# EAGLE board MegaFly_rev4.1.1 (EAGLE 6.5.0)
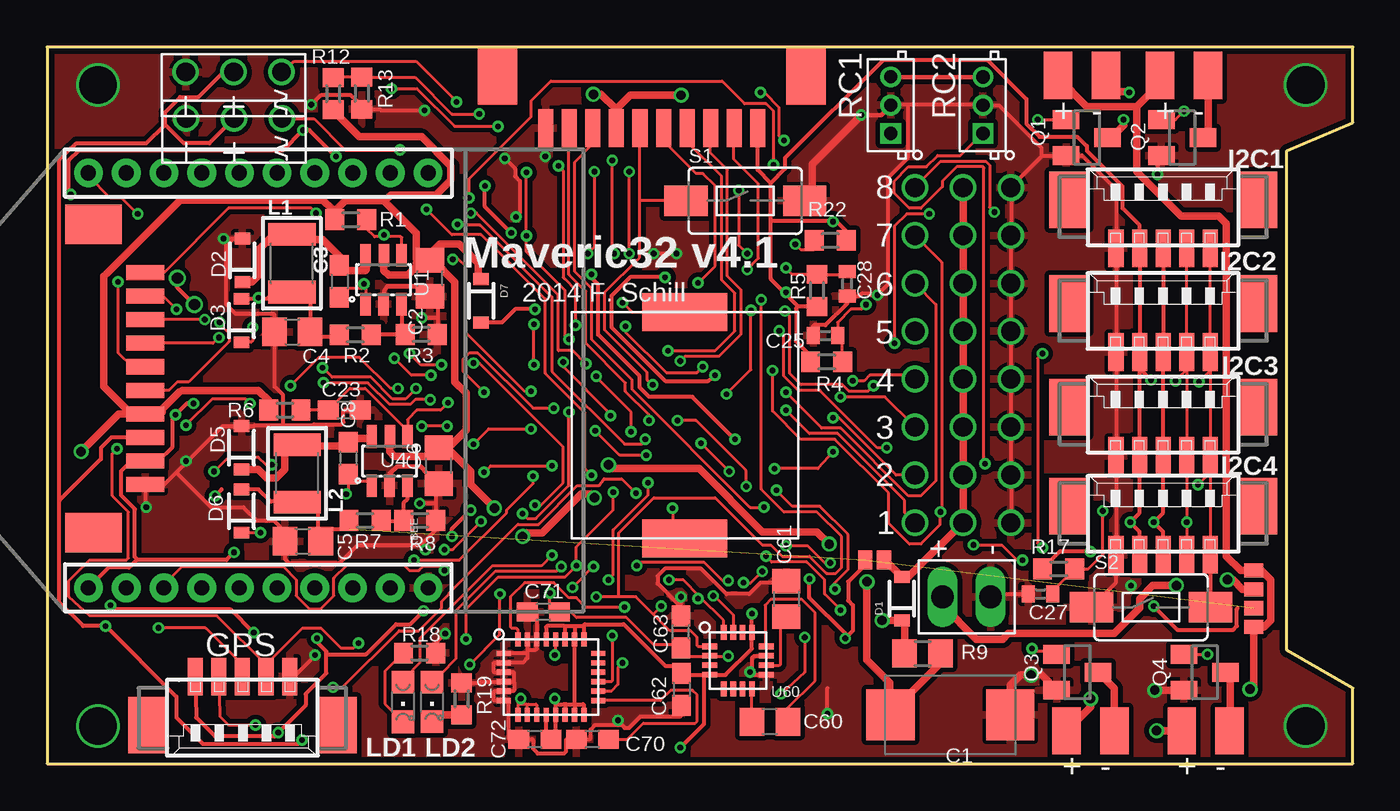
[diagram p2: board, top side]
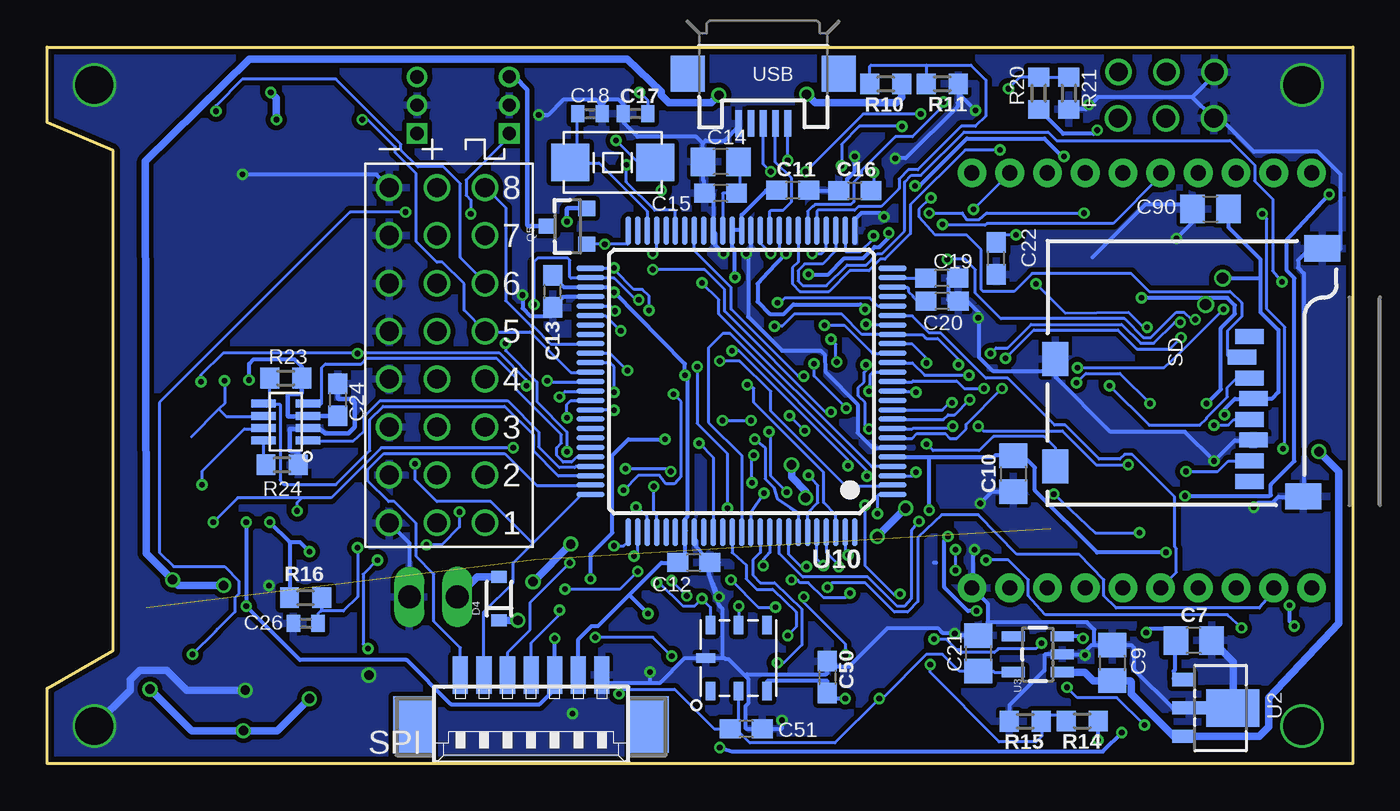
[diagram p3: board, bottom side, seen from below]

Size 69.2 x 38 mm. Coordinates in mm from the lower left corner, seen from the top.
Outline: 0,0 69.2,0 69.2,4 65.7,6 65.7,32.5 69.2,34 69.2,38 0,38 0,0
Copper layers (1*16): Top 0.035mm / dielectric 1.5mm / Bottom 0.035mm
Design rules "PCB-POOL Standard": minimum track width 0.15mm, minimum drill 0.3mm, track to track 0.15mm, track to pad 0.15mm, pad to pad 0.15mm, via to via 0.15mm, smd to smd 0.15mm, copper to edge 0.3mm, drill to drill 0.2mm, minimum pad ring 0.2mm, minimum via ring 0.15mm, stop-mask expansion 0.075mm, vias tented up to drill 0mil, thermal gap 0.2mm
Net classes: 0 default: width 0.15 mm, drill 0.3 mm, clearance 0.15 mm; 1 power: width 0.2 mm, drill 0.3 mm, clearance 0.15 mm; 2 more_power: width 0.4 mm, drill 0.5 mm, clearance 0.15 mm

## Footprints (pad centres in the part's own frame; a part is rotated, then mirrored left to right if it is on the bottom)
MOLEX_CONNECTOR_10PINS = smd 0.8 x 2: P$1 -11.65,-0.65; P$2 -10.4,-0.65; P$3 -9.15,-0.65; P$4 -7.9,-0.65; P$5 -6.65,-0.65; P$6 -5.4,-0.65; P$7 -4.15,-0.65; P$8 -2.9,-0.65; P$9 -1.65,-0.65; P$10 -0.4,-0.65 | smd 2.1 x 3: P$11 -14.2,-3.4; P$12 2.15,-3.4
D/7343-31R = smd 2.55 x 2.7: + 3.175,0; - -3.175,0
C0805 = smd 1.3 x 1.5: 1 -0.95,0; 2 0.95,0
C0603 = smd 1.1 x 1: 1 -0.85,0; 2 0.85,0
C0402 = smd 0.7 x 0.9: 1 -0.65,0; 2 0.65,0
SOD-323 = smd 0.63 x 0.83: 1 -1.15,0; 2 1.15,0
MOLEX_CONNECTOR_5_PINS_VERTICAL = smd 0.8 x 2: 1 2.5,-2.82; 2 1.25,-2.82; 3 0,-2.82; 4 -1.25,-2.82; 5 -2.5,-2.82 | smd 2.1 x 3: S1 5,-0.25; S2B -5,-0.25
SOLDER_JUMPER_2WAY = smd 0.75 x 1: P$1 -0.5,0; P$2 0.5,0
C1210 = smd 1.2 x 2.5: 1 -1.524,0; 2 1.524,0
CHIPLED_0805 = smd 1.2 x 1.2: A 0,-1.05; C 0,1.05
POWER = drill 1.2 long: P$1 0,2.54; P$2 0,0
JST_1.5MM_3WAY = drill 0.7 square: P$1 0,1.5 | drill 0.7: P$2 0,0; P$3 0,-1.5
SERVO_COMPACT = drill 1: P$1 0,2.54; P$2 0,0; P$3 0,-2.54
POWER_SMALL_SMD = smd 1.5 x 2.5: + -1.27,0; - 1.27,0
SOT23 = smd 1 x 1.4: 1 -0.95,-1.1; 2 0.95,-1.1; 3 0,1.1
SOT23-3 = smd 0.8 x 0.9: 1 -0.95,-1; 2 0.95,-1; 3 0,1.1
R0603 = smd 1 x 1.1: 1 -0.85,0; 2 0.85,0
R0805 = smd 1.3 x 1.5: 1 -0.95,0; 2 0.95,0
TACTILE-SWITCH-1101NE = smd 2.3 x 1.6: P$1 -3.15,0; P$2 3.15,0
MICRO-SD-SOCKET-PP = smd 0.8 x 1.5: 1 -8.94,10.7; 2 -7.84,10.3; 3 -6.74,10.7; 4 -5.64,10.9; 5 -4.54,10.7; 6 -3.44,10.9; 7 -2.34,10.7; 8 -1.24,10.7 | smd 1.8 x 1.4: CD1 -2.05,0.4; CD2 -7.75,0.4 | smd 1.4 x 1.9: GND1 -13.6,14.55; GND3 -0.45,13.55
HEADER3X8 = drill 1.016: P$1 -2.54,10.16; P$2 0,10.16; P$3 2.54,10.16; P$4 -2.54,7.62; P$5 0,7.62; P$6 2.54,7.62; P$7 -2.54,5.08; P$8 0,5.08; P$9 2.54,5.08; P$10 -2.54,2.54; P$11 0,2.54; P$12 2.54,2.54; P$13 -2.54,0; P$14 0,0; P$15 2.54,0; P$16 -2.54,-2.54; P$17 0,-2.54; P$18 2.54,-2.54; P$19 -2.54,-5.08; P$20 0,-5.08; P$21 2.54,-5.08; P$22 -2.54,-7.62; P$23 0,-7.62; P$24 2.54,-7.62
SOT23-8L = smd 1.3 x 0.42: P$1 -1.175,1.3; P$2 -1.175,0.65; P$3 -1.175,0; P$4 -1.175,-0.65; P$5 1.175,-0.65; P$6 1.175,0; P$7 1.175,0.65; P$8 1.175,1.3
PIEZO_CMT_1203-SMT-REDUCED_FOOTPRINT = smd 4.5 x 2: P$1 0,6; P$2 0,-6
MOLEX_CONNECTOR_7PINS = smd 0.8 x 2: 1 3.75,-2; 2 2.5,-2; 3 1.25,-2; 4 0,-2; 5 -1.25,-2; 6 -2.5,-2; 7 -3.75,-2 | smd 2.1 x 3: S1 6.25,0.625; S2 -6.25,0.625
SOT23-6 = smd 0.55 x 1.2: 1 -0.95,-1.3; 2 0,-1.3; 3 0.95,-1.3; 4 0.95,1.3; 5 0.015,1.3; 6 -0.95,1.3
SOT89 = smd 0.7 x 1.1: 1 -1.5,-1.75; 3 1.5,-1.75 | smd 0.7 x 1.8: 2 0,-1.4 | smd 2 x 2.8: 4 0,0.9
SOT23-5 = smd 0.55 x 1.2: 1 -0.95,-1.3; 2 0,-1.3; 3 0.95,-1.3; 4 0.95,1.3; 5 -0.95,1.3
TQFP100 = smd 1.5 x 0.3: 1 -8,6; 2 -8,5.5; 3 -8,5; 4 -8,4.5; 5 -8,4; 6 -8,3.5; 7 -8,3; 8 -8,2.5; 9 -8,2; 10 -8,1.5; 11 -8,1; 12 -8,0.5; 13 -8,0; 14 -8,-0.5; 15 -8,-1; 16 -8,-1.5; 17 -8,-2; 18 -8,-2.5; 19 -8,-3; 20 -8,-3.5; 21 -8,-4; 22 -8,-4.5; 23 -8,-5; 24 -8,-5.5; 25 -8,-6; 51 8,-6; 52 8,-5.5; 53 8,-5; 54 8,-4.5; 55 8,-4; 56 8,-3.5; 57 8,-3; 58 8,-2.5; 59 8,-2; 60 8,-1.5; 61 8,-1; 62 8,-0.5; 63 8,0; 64 8,0.5; 65 8,1; 66 8,1.5; 67 8,2; 68 8,2.5; 69 8,3; 70 8,3.5; 71 8,4; 72 8,4.5; 73 8,5; 74 8,5.5; 75 8,6 | smd 0.3 x 1.5: 26 -6,-8; 27 -5.5,-8; 28 -5,-8; 29 -4.5,-8; 30 -4,-8; 31 -3.5,-8; 32 -3,-8; 33 -2.5,-8; 34 -2,-8; 35 -1.5,-8; 36 -1,-8; 37 -0.5,-8; 38 0,-8; 39 0.5,-8; 40 1,-8; 41 1.5,-8; 42 2,-8; 43 2.5,-8; 44 3,-8; 45 3.5,-8; 46 4,-8; 47 4.5,-8; 48 5,-8; 49 5.5,-8; 50 6,-8; 76 6,8; 77 5.5,8; 78 5,8; 79 4.5,8; 80 4,8; 81 3.5,8; 82 3,8; 83 2.5,8; 84 2,8; 85 1.5,8; 86 1,8; 87 0.5,8; 88 0,8; 89 -0.5,8; 90 -1,8; 91 -1.5,8; 92 -2,8; 93 -2.5,8; 94 -3,8; 95 -3.5,8; 96 -4,8; 97 -4.5,8; 98 -5,8; 99 -5.5,8; 100 -6,8
BMP180 = smd 0.5 x 1: 1 -1.5,-1.75; 2 0,-1.75; 3 1.5,-1.75; 4 1.5,1.75; 5 0,1.75; 6 -1.5,1.75 | smd 1 x 0.5: 7 -1.75,0
LPCC16_0.5MM = smd 0.8 x 0.3: P$1 -1.5,0.75; P$2 -1.5,0.25; P$3 -1.5,-0.25; P$4 -1.5,-0.75; P$9 1.5,-0.75; P$10 1.5,-0.25; P$11 1.5,0.25; P$12 1.5,0.75 | smd 0.3 x 0.8: P$5 -0.75,-1.5; P$6 -0.25,-1.5; P$7 0.25,-1.5; P$8 0.75,-1.5; P$13 0.75,1.5; P$14 0.25,1.5; P$15 -0.25,1.5; P$16 -0.75,1.5
LSM330DLC = smd 0.75 x 0.28: P$1 -2.5,1.25; P$2 -2.5,0.75; P$3 -2.5,0.25; P$4 -2.5,-0.25; P$5 -2.5,-0.75; P$6 -2.5,-1.25; P$15 2.5,-1.25; P$16 2.5,-0.75; P$17 2.5,-0.25; P$18 2.5,0.25; P$19 2.5,0.75; P$20 2.5,1.25 | smd 0.28 x 0.75: P$7 -1.75,-2; P$8 -1.25,-2; P$9 -0.75,-2; P$10 -0.25,-2; P$11 0.25,-2; P$12 0.75,-2; P$13 1.25,-2; P$14 1.75,-2; P$21 1.75,2; P$22 1.25,2; P$23 0.75,2; P$24 0.25,2; P$25 -0.25,2; P$26 -0.75,2; P$27 -1.25,2; P$28 -1.75,2
USB-MICROB = smd 0.35 x 1.4: D+ 0,2.65; D- -0.65,2.65; GND 1.3,2.65; ID 0.65,2.65; VBUS -1.3,2.65 | smd 1.8 x 1.9: MT1 -4,0; MT2 4,0
SMD_CRYSTAL_ABM = smd 2 x 2: P$1 -2.25,0; P$2 2.25,0
XBEE-1 = drill 0.8 pad 1.524: 1 -11,20; 2 -11,18; 3 -11,16; 4 -11,14; 5 -11,12; 6 -11,10; 7 -11,8; 8 -11,6; 9 -11,4; 10 -11,2; 11 11,2; 12 11,4; 13 11,6; 14 11,8; 15 11,10; 16 11,12; 17 11,14; 18 11,16; 19 11,18; 20 11,20

## Placement (x,y rotation side)
ANA  MOLEX_CONNECTOR_10PINSMOLEX_PICOBLADE  [MOLEX_CONNECTOR_10PINS]  5.85,14.4 270 top
C1  100uF  [D/7343-31R]  47.87,2.59 180 top
C2  10uF  [C0805]  20.28,25.73 90 top
C3  100nF  [C0603]  15.49,25.58 270 top
C4  10uF  [C0805]  12.99,22.9 0 top
C5  10uF  [C0805]  13.55,11.8 0 top
C6  10uF  [C0805]  20.75,15.8 90 top
C7  10uF  [C0805]  8.43,6.53 180 bottom
C8  100nF  [C0603]  15.95,16.2 270 top
C9  10uF  [C0805]  12.75,5.35 270 bottom
C10  10uF  [C0805]  18,15.38 270 bottom
C11  100nF  [C0603]  29.69,30.41 180 bottom
C12  100nF  [C0603]  34.93,10.67 180 bottom
C13  100nF  [C0603]  42.4,25.05 90 bottom
C14  10uF  [C0805]  33.5,31.92 180 bottom
C15  100nF  [C0603]  33.51,30.26 180 bottom
C16  100nF  [C0603]  26.39,30.38 0 bottom
C17  22pF  [C0402]  38.01,34.48 180 bottom
C18  22pF  [C0402]  40.44,34.46 0 bottom
C19  100nF  [C0603]  21.78,25.75 180 bottom
C20  100nF  [C0603]  21.77,24.53 180 bottom
C21  10uF  [C0805]  19.85,5.85 270 bottom
C22  100nF  [C0603]  18.9,26.8 90 bottom
C23  100nF  [C0603]  15.75,18.75 180 top
C24  100nF  [C0603]  53.8,19.3 270 bottom
C25  22pF  [C0402]  41.25,22.7 0 top
C26  22pF  [C0402]  55.5,7.45 0 bottom
C27  22pF  [C0402]  52.65,9 0 top
C28  22pF  [C0402]  42.4,25.45 90 top
C50  100nF  [C0603]  27.86,4.59 270 bottom
C51  100nF  [C0603]  32.15,1.85 180 bottom
C60  220nF  [C0805]  38.3,2.22 180 top
C61  4.7uF  [C0805]  39.17,8.74 270 top
C62  100nF  [C0603]  33.62,3.94 270 top
C63  100nF  [C0603]  33.59,6.99 90 top
C70  100nF  [C0603]  28.9,1.3 180 top
C71  100nF  [C0603]  26.3,8.05 180 top
C72  100nF  [C0603]  25.85,1.3 180 top
C90  10uF  [C0805]  7.55,29.42 0 bottom
D1  [SOD-323]  45.3,8.75 90 top
D2  [SOD-323]  10.35,26.7 90 top
D3  [SOD-323]  10.3,23.5 90 top
D4  [SOD-323]  45.25,8.75 90 bottom
D5  [SOD-323]  10.3,16.75 90 top
D6  [SOD-323]  10.3,13.4 90 top
D7  [SOD-323]  23,24.55 270 top
GPS  APM2.5_GPS_HEADERVERTICAL  [MOLEX_CONNECTOR_5_PINS_VERTICAL]  10.35,1.8 180 top
I2C1  I2C_BUS_PICOVERTICAL  [MOLEX_CONNECTOR_5_PINS_VERTICAL]  59.15,30.15 0 top
I2C2  I2C_BUS_PICOVERTICAL  [MOLEX_CONNECTOR_5_PINS_VERTICAL]  59.15,24.65 0 top
I2C3  I2C_BUS_PICOVERTICAL  [MOLEX_CONNECTOR_5_PINS_VERTICAL]  59.15,19.15 0 top
I2C4  I2C_BUS_PICOVERTICAL  [MOLEX_CONNECTOR_5_PINS_VERTICAL]  59.15,13.9 0 top
J1  SOLDER_JUMPER_2WAY  [SOLDER_JUMPER_2WAY]  43.85,10.8 180 top
J2  SOLDER_JUMPER_2WAY  [SOLDER_JUMPER_2WAY]  63.95,9.75 270 top
J3  SOLDER_JUMPER_2WAY  [SOLDER_JUMPER_2WAY]  63.95,7.75 90 top
L1  10uH  [C1210]  12.97,26.54 270 top
L2  10uH  [C1210]  13.25,15.4 270 top
LD1  green  [CHIPLED_0805]  18.86,3.27 180 top
LD2  red  [CHIPLED_0805]  20.4,3.28 180 top
P1  POWER  [POWER]  50,8.84 90 top
P2  AVR32_JTAG+SERIALMOLEX_PICOBLADE  [MOLEX_CONNECTOR_10PINS]  26.02,33.05 180 top
P5  SPEKTRUM_RECEIVER  [JST_1.5MM_3WAY]  44.7,34.93 180 top
P6  SPEKTRUM_RECEIVER  [JST_1.5MM_3WAY]  49.59,34.92 180 top
P8  SENSOR  [SERVO_COMPACT]  9.88,36.68 270 top
P9  SENSOR  [SERVO_COMPACT]  9.91,34.23 270 top
P10  POWERSMALL_SMD  [POWER_SMALL_SMD]  54.85,36.5 0 top
P11  POWERSMALL_SMD  [POWER_SMALL_SMD]  60.25,36.5 0 top
P12  POWERSMALL_SMD  [POWER_SMALL_SMD]  55.3,1.75 0 top
P13  POWERSMALL_SMD  [POWER_SMALL_SMD]  61.4,1.75 0 top
Q1  N-CHANNEL_SOT23  [SOT23]  55.1,33.2 270 top
Q2  N-CHANNEL_SOT23  [SOT23]  60.15,33.2 270 top
Q3  N-CHANNEL_SOT23  [SOT23]  54.6,4.85 270 top
Q4  N-CHANNEL_SOT23  [SOT23]  61.35,4.85 270 top
Q5  MOSFET-PCHANNELSMD  [SOT23-3]  41.6,28.5 90 bottom
R1  100k  [R0603]  16.09,28.85 180 top
R2  31.6k  [R0603]  16.33,22.74 0 top
R3  10k  [R0603]  19.83,22.76 0 top
R4  6k8  [R0603]  41.31,21.31 0 top
R5  6k8  [R0603]  40.8,25.1 90 top
R6  100k  [R0603]  12.6,18.75 180 top
R7  56k  [R0603]  16.85,12.9 0 top
R8  10k  [R0603]  19.75,12.9 0 top
R9  0.25R  [R0805]  46.4,5.85 0 top
R10  22k  [R0603]  24.76,36.04 0 bottom
R11  1k  [R0603]  21.76,36.05 180 bottom
R12  22k  [R0603]  15.16,35.53 270 top
R13  1k  [R0603]  16.68,35.55 90 top
R14  18k  [R0603]  14.34,2.27 0 bottom
R15  2.2k  [R0603]  17.35,2.25 0 bottom
R16  6k8  [R0603]  55.51,8.8 0 bottom
R17  6k8  [R0603]  53.61,10.33 0 top
R18  1k  [R0603]  19.74,5.87 180 top
R19  1k  [R0603]  21.96,3.45 270 top
R20  18k  [R0603]  16.65,35.55 270 bottom
R21  2.2k  [R0603]  15.05,35.55 90 bottom
R22  1k  [R0603]  41.5,27.75 180 top
R23  1k  [R0603]  56.55,20.45 0 bottom
R24  25k  [R0603]  56.75,15.85 0 bottom
S1  SWITCH-MOMENTARY-2SMD-1101NE  [TACTILE-SWITCH-1101NE]  37,29.85 0 top
S2  SWITCH-MOMENTARY-2SMD-1101NE  [TACTILE-SWITCH-1101NE]  58.5,8.3 0 top
SD  USD-SOCKETNEW  [MICRO-SD-SOCKET-PP]  16.17,13.72 270 bottom
SERVO  SERVOCONNECTOR_X8STANDARD  [HEADER3X8]  48.54,22.93 180 bottom
SOT1  MAX3051  [SOT23-8L]  56.55,18.45 180 bottom
SP  PIEZO_SPEAKERSMALLER  [PIEZO_CMT_1203-SMT-REDUCED_FOOTPRINT]  33.8,17.95 0 top
SPI  MOLEX_CONNECTOR_7PINS  [MOLEX_CONNECTOR_7PINS]  43.55,2.7 180 bottom
U1  LM2734  [SOT23-6]  17.83,25.66 0 top
U2  MC78L05  [SOT89]  7.27,2.96 270 bottom
U3  V_REG_MIC5235-3.3  [SOT23-5]  16.7,5.8 90 bottom
U4  LM2734  [SOT23-6]  18.15,16.05 0 top
U10  AT32UC3C1512/1256/1128  [TQFP100]  32.4,20.27 180 bottom
U50  BMP180  [BMP180]  32.55,5.6 0 bottom
U60  HMC5883L  [LPCC16_0.5MM]  36.61,5.47 0 top
U70  LSM330DLC  [LSM330DLC]  26.7,4.6 0 top
USB  USB-MICROB  [USB-MICROB]  31.25,36.6 180 bottom
X1  CRYSTAL:ABM_16MHz  [SMD_CRYSTAL_ABM]  39.22,31.88 0 bottom
XBEE  XBEE-1B1  [XBEE-1]  22.19,20.33 90 top

## Tracks (layer width: path | path; a pad name or v marks a point on that pad's centre or on a via)
3V3_ANA  (via drill 0.3)
  Top 0.15: U70.P$7 24.95,3.1 25,3.15 | 25,3.15 25.4,3.15 25.45,3.1 | U70.P$8 25.45,3.1 | U70.P$9 25.95,3.1 25.9,3.15 25.5,3.15 25.45,3.1 | v25.1,3.45 24.95,3.3 24.95,3.2 25,3.15 | v25.4,31.35 v25.4,28 25.4,27.15 27.45,25.1 27.45,22.7 v27.65,22.5 | v27.35,21.3 27.35,21.05 29.85,18.55 v29.85,18.45 | v29.05,17.65 30.35,16.35 v31.75,16.35 | v31.85,14.9 31.85,14.25 30,12.4 30,10 v29.75,9.75 | v26.65,9.05 26.65,8.1 26.7,8.05 C71.1 27.75,8.05 28.05,7.75 30.7,7.75 32.15,6.3 33.6,6.3 33.6,6.2 C63.1 33.6,6.1 33.6,5.75 33.65,5.7 35.1,5.7 U60.P$2 35.15,5.7 v36.1,5.7 | v38.9,3.7 40.15,4.85 v40.15,6.7
  Bottom 0.15: U50.2 32.55,1.9 32.6,1.85 C51.2 | U3.5 19,4.85 19.05,4.9 C21.2 20.85,4.9 21.75,5.8 22.6,5.8 24.95,3.45 v25.1,3.45 27.45,1.1 31.95,1.1 32.55,1.7 32.55,1.8 C51.2 | v25.4,31.35 25.4,30.8 25.45,30.4 25.5,30.4 C16.2 | v25.4,28 25.4,27.85 26.1,27.15 26.85,27.15 26.9,27.2 U10.27 | v27.35,21.3 27.4,21.4 27.4,22.25 v27.65,22.5 | v29.05,17.65 v29.85,18.45 | v31.75,16.35 31.85,16.15 v31.85,14.9 | v29.75,9.75 29.45,9.75 29.3,9.6 28.85,9.6 28.05,8.8 26.9,8.8 v26.65,9.05 | C51.2 33.85,1.85 35.95,3.95 38.75,3.95 v38.9,3.7 | v40.15,6.7 37.1,6.7 v36.1,5.7
5V_ANA  (via drill 0.3)
  Top 0.2: 6.25,33.9 6.25,34.55 7.05,35.35 8,35.35 9.3,36.65 9.85,36.65 P8.P$2 | 6.25,33.9 7.25,32.9 8.6,32.9 9.9,34.2 P9.P$2 | v3.35,8.4 3.55,8.2 9.7,8.2 v10.95,6.95 | 6.25,33.9 5.25,32.9 1.55,32.9 0.65,32.05 0.65,13.95 | 0.65,13.95 0.65,8.55 1.9,7.3 v3.1,7.3 6.85,3.55 6.85,2.45 8.25,1.05 13.3,1.05 v13.5,1.25 13.35,1.1 | ANA.P$8 3.4,17.3 2.85,16.75 2.85,16.15 0.65,13.95
  Bottom 0.2: U2.1 9.05,4.45 9.45,4.45 9.5,4.5 9.5,4.9 9.45,4.95 9.45,5.9 C7.2 9.45,6 9.45,6.6 10,7.15 10.75,7.15 v10.95,6.95 | v13.5,1.25 13.5,2.05 R14.2 | v3.35,8.4 3.35,7.55 v3.1,7.3
6V_ENABLE  (via drill 0.3)
  Top 0.15: R6.1 13.45,18.3 13.5,18.3 13.95,18.75 C23.2 15.3,18.75 15.35,18.8 15.35,19.2 16.05,19.9 16.85,19.9 19.1,17.65 U4.4 19.05,17.8 19.1,17.85 19.1,18.25 19.6,18.75 20.85,18.75 v21.25,19.15
  Bottom 0.15: 21.3,19.2 21.3,19.35 | 21.3,19.2 21.75,18.75 24.4,18.75 U10.10 | v21.25,19.15 21.3,19.2
+3V3  (via drill 0.3, 0.6)
  Top 0.2: I2C1.4 I2C2.4 | I2C4.4 57.9,12.3 v57.4,12.8 57.9,13.3 I2C3.4 I2C2.4 | 39.8,24.25 39.7,24.15 39.7,22.4 40.45,21.65 40.45,21.35 R4.1 | R5.1 39.8,24.25 | 38.35,30.8 37.65,31.5 37.65,33.7 P2.P$1 | 38.35,28.8 38.35,25.7 39.1,24.95 | 38.35,28.8 38.35,30.8 | 39.8,24.25 39.1,24.95 | v39.15,25 39.1,24.95 | 57.9,27.65 I2C1.4 | 13.95,22.65 15.4,22.65 15.5,22.7 R2.1 | 13.95,22.65 13.95,22.85 C4.2 13.95,23 13.95,24.95 13.9,25 13.05,25 L1.2 12.95,25 12,25 11.65,24.65 11.2,24.65 | 13.95,22.65 13.95,22.6 | 11.2,24.65 D3.2 | 4.5,16.05 ANA.P$9 | v9.9,11.2 9.5,10.8 4.75,10.8 | v11.2,24.7 11.2,24.65 | v14.3,6.65 14.3,6.45 14.8,5.95 14.8,5.8 | 14.8,5.8 14.8,4.8 13.7,3.7 13.7,3.1 v12.25,1.65 12.05,1.45 8.9,1.45 7.9,2.45 GPS.1 | U60.P$4 35.1,4.7 33.6,4.7 33.6,4.75 C62.1 33.6,4.85 33.6,5.15 33.55,5.2 32.75,5.2 30.55,7.4 28.5,7.4 28.45,7.35 28.45,7.3 | U60.P$4 35.2,4.7 35.95,4.7 37.35,6.1 37.35,6.95 U60.P$13 37.35,7.05 v37.35,7.95 | U70.P$25 26.45,7.25 26.5,7.3 27.4,7.3 27.45,7.25 | U70.P$23 27.45,7.25 | 27.45,7.25 27.45,7.3 27.95,7.3 | 27.95,7.3 U70.P$22 27.95,3.2 27.9,3.15 | 28.45,7.3 U70.P$21 | 27.95,7.3 28.45,7.3 | U70.P$10 26.45,1.3 C72.1 26.95,1.3 U70.P$11 26.95,3.1 27,3.15 | 27.45,3.1 U70.P$12 | 27.45,3.1 27.4,3.15 27,3.15 | 27.95,3.1 U70.P$13 | 27.9,3.15 27.95,3.1 | 27.9,3.15 27.5,3.15 27.45,3.1 | U70.P$14 28.45,3.1 28.4,3.15 28,3.15 27.95,3.1 | v26.9,3.45 26.95,3.4 26.95,3.2 27,3.15 | v33.55,0.85 34.8,2.1 34.8,4.65 U60.P$4 | v22.45,13.45 21.45,12.45 v21.45,12.05 | v19.95,8.1 19.25,7.4 18.5,7.4 16.9,5.8 14.8,5.8 | v32.75,25.8 30.9,25.8 29.9,24.8 29.9,23.15 32.75,20.3 35.05,20.3 v35.4,20.6 | R22.1 42.35,28.25 41.8,28.8 41.65,28.8 38.35,28.8
  Top 0.2: 38.35,30.8 39.1,31.55 39.1,32.1 44.3,37.3 49.85,37.3 51.9,35.25 51.9,33.95 52.6,33.25 54.6,33.25 55.1,32.75 55.1,32.5 57,30.6 57,29.45 57.9,28.55 I2C1.4 | v55.3,11.25 53.68,11.25 R17.1 | ANA.P$9 4.55,16.05 | 4.75,10.8 4.35,10.4 3.26,10.4 XBEE.1 | 4.75,10.8 4.75,10.85 4.65,10.95 4.65,13.5 3.9,14.25 3.9,15.5 4.45,16.05 ANA.P$9 | ANA.P$9 5.9,16.05 6.65,16.8 6.65,18.35 v6.8,18.5 7.4,19.1 v7.75,19.1 | I2C2.4 57.9,20.95 v58.5,20.35 | v6.9,25.75 6.9,25.25 v7.8,24.35
  Top 0.25: v41.65,28.75 41.65,28.8
  Bottom 0.2: R16.1 56.35,8.85 56.35,11.75 | v57.4,12.8 56.35,11.75 | C11.2 31.1,30.4 32.4,29.1 U10.38 32.45,28.3 32.9,28.3 U10.39 32.9,27.4 32.75,27.25 v32.75,25.8 | 4.9,25.75 4.9,26.75 6.6,28.45 C90.2 | 4.9,25.75 4.9,23.95 3.95,23 3.95,19.7 4.3,19.35 5.25,19.35 SD.4 5.35,19.35 6.25,19.35 6.8,18.8 v6.8,18.5 | 22.45,16.25 19.05,16.25 18.95,16.35 18,16.35 C10.1 17.9,16.35 17.5,16.35 16.85,15.7 16.85,14.5 13.55,11.2 v9.9,11.2 | 22.45,16.25 24.4,16.25 U10.5 | 7.8,24.7 6.65,24.7 6.25,24.3 6.25,23.85 7,23.1 7,19.85 v7.75,19.1 | 7.8,24.7 v11.2,24.7 | 38.35,8.95 40,7.3 40.35,7.3 41.05,6.6 SPI.6 | 38.35,8.95 36.65,10.65 35.85,10.65 C12.2 35.75,10.65 35.45,11 35.4,11.05 U10.82 35.35,12.35 35.4,12.4 35.4,12.95 35.25,13.1 35.25,20.45 v35.4,20.6 35.4,21.2 v39.15,25 39.4,25.25 40.35,25.25 U10.53 40.4,25.25 41.8,25.25 42.4,25.85 C13.2 42.4,25.95 | U3.3 14.4,6.75 v14.3,6.65 | U50.3 31.05,4.35 31,4.4 27.9,4.4 27.85,4.35 C50.2 27.85,3.65 27.85,3.45 v26.9,3.45 | v33.55,0.85 32.9,0.65 13.25,0.65 v12.25,1.65 | v37.35,7.95 38.35,8.95 | v22.45,13.45 22.45,16.25 | v21.45,12.05 21.65,11.85 21.65,9.35 20.4,8.1 v19.95,8.1 | 56.35,11.75 55.8,11.75 v55.3,11.25 | v58.5,20.35 58.5,21.2 58.25,21.45 56.1,21.45 55.7,21.05 R23.2 | v6.9,25.75 4.9,25.75 | 7.8,24.7 v7.8,24.35
  Bottom 0.25: C24.2 SOT1.P$3 55.38,18.4 56.4,18.4 56.45,18.45 56.45,19.55 56.4,19.6 55.75,19.6 55.7,19.65 R23.2 | v41.65,28.75 41.65,29.4 41.6,29.45 Q5.2
+5V  (2 unrouted)
  Top 0.2: R7.1 16,12.45 14.35,12.45 | D6.2 11.2,14.55 11.85,13.9 13.25,13.9 L2.2 13.3,13.9 14.25,13.9 14.35,13.65 14.35,12.45 | 14.35,12.45 C5.2 | J3.P$2 64,8.25
+6V  (via drill 0.3)
  Top 0.2: v1.25,30.2 1.15,30.2 1.15,32 1.7,32.55 12.5,32.55 v13.55,33.6 13.9,33.6 v15.3,32.2 | 9.25,14.55 v8.9,14.2 | I2C2.3 I2C1.3 59.15,27.55 | I2C4.3 59.15,12.3 v58.65,12.8 59.15,13.3 I2C3.3 | 59.15,16.55 I2C3.3 | I2C3.3 I2C2.3 | 59.15,22 I2C2.3 | v23.2,30.65 23.2,29.55 v24.6,28.15 | v28.85,25.95 28.85,25.75 29.2,25.4 29.2,22.75 31.4,20.55 31.4,19.95 31.9,19.45 34.2,19.45 v36.45,17.2 | v40.4,9.8 40.4,8.8 42.3,6.9 v42.3,6.65 42.7,7.05 42.7,8.4 42.45,8.65 42.45,9.65 43.35,10.55 | v58.65,8.35 59.9,7.1 62.85,7.1 63.05,7.3 63.05,8.2 63.1,8.25
  Bottom 0.2: R20.2 15.35,33.4 13.75,33.4 v13.55,33.6 | v1.25,30.2 3.25,28.05 3.5,27.8 3.5,26.15 3.1,25.75 3.1,16.05 4.35,14.8 4.35,14.25 4.4,14.2 v8.9,14.2 | 42.3,4.3 SPI.5 | v58.65,12.8 v58.65,8.35 55.8,5.5 50.15,5.5 47.8,3.15 43.1,3.15 42.3,3.95 SPI.5 | v15.3,32.2 15.4,32.2 16.35,33.15 20.45,33.15 22.95,30.65 v23.2,30.65 | v24.6,28.15 24.6,27.9 25.1,27.4 25.35,27.4 25.95,26.8 26.95,26.8 27.8,25.95 v28.85,25.95 | v36.45,17.2 38.4,17.2 39.25,16.35 39.25,12.25 40.4,11.1 v40.4,9.8 | SPI.5 v42.3,6.65
+12V  (via drill 0.5)
  Top 0.4: 30.15,34.7 30.15,33.7 P2.P$7
  Top 0.406: P1.P$1 47.46,8.39 49.25,6.6 50.65,6.6 50.95,6.9 56.55,6.9 57.9,8.25 57.9,8.75 58.6,9.45 v59.85,9.45 | v28.95,35.5 29.35,35.5 30.15,34.7 30.9,35.45 v33.6,35.45 | v62.55,9.75 62.85,9.75 63.35,9.25 J2.P$2
  Bottom 0.4: D4.2 46.4,9.9 P1.P$1 | 23.9,35.35 23.9,36 R10.2 | 36.65,35.65 38.45,37.35 58.5,37.35 64,31.95 63.95,11.45
  Bottom 0.406: 23.9,35.35 24.2,35.05 28.5,35.05 v28.95,35.5 | 36.65,35.65 36.65,35.45 36.25,35.05 34,35.05 v33.6,35.45 | v59.85,9.45 62.25,9.45 v62.55,9.75 63.95,11.15 63.95,11.45
ADC2  (via drill 0.3)
  Top 0.15: ANA.P$1 6.2,26.05 9.6,29.45 14,29.45 v14.25,29.2 | v22.45,29.2 22.75,29.2 27.1,24.85 27.1,21.9 27.85,21.9 v28.55,21.2 | v26.85,18.85 25.75,18.85 22.8,21.8 22.4,21.8 22.05,21.45 22.05,20.8 v23.15,19.7
  Bottom 0.15: v14.25,29.2 19.4,29.2 19.8,28.85 20.45,28.85 20.7,29.2 v22.45,29.2 | v28.55,21.2 28.55,20.55 v26.85,18.85 | v23.15,19.7 23.3,19.7 23.35,19.75 24.4,19.75 U10.12
ADC3  (via drill 0.3)
  Top 0.15: ANA.P$2 6.15,24.8 v6.85,24.1 | v14.6,21 15.1,20.5 17.15,20.5 18.3,19.35 19,19.35 v19.55,19.9
  Bottom 0.15: v6.85,24.1 9.25,21.7 10,21 v14.6,21 | v19.55,19.9 20.6,19.9 21,20.3 23.3,20.3 23.35,20.25 24.4,20.25 U10.13
ADC4  (via drill 0.3)
  Top 0.15: v8.35,23.55 ANA.P$3 | v21.5,26.75 21.8,26.75 22.2,26.35 22.2,22.85 25.3,19.75 v25.65,19.75
  Bottom 0.15: v8.35,23.55 8.55,23.55 8.95,23.95 9.35,23.95 10.7,22.6 11.1,22.6 12.1,23.6 18.65,23.6 20,24.95 20,26.2 20.55,26.75 v21.5,26.75 | v25.65,19.75 25.65,20.05 25.6,20.1 25.6,20.6 25.45,20.75 24.4,20.75 U10.14
ADC5  (via drill 0.3)
  Top 0.15: ANA.P$4 8.8,22.3 v9.1,22.6 | v18.4,21.5 19.3,20.6 v20.35,20.6
  Bottom 0.15: v9.1,22.6 9.7,22 11.45,22 12.45,23 16.9,23 v18.4,21.5 | v20.35,20.6 22.7,20.6 23.35,21.25 24.4,21.25 U10.15
ADC6  (via drill 0.3)
  Top 0.15: v28,23.25 28,25.15 27.43,25.73 27.35,25.8 27.35,31.45 v27.1,31.7 | v23.9,33.8 21.6,33.8 19.6,35.8 v18.25,35.8
  Bottom 0.15: R21.2 R20.1 17.65,36.4 v18.25,35.8 | v28,23.25 26.95,23.25 25.45,21.75 24.4,21.75 U10.16 | v23.9,33.8 26.15,33.8 27.1,32.85 v27.1,31.7
ADC7  (via drill 0.3)
  Top 0.15: v22.6,21.25 22.9,21.25 27.35,16.8 27.35,14.9 26.15,13.7 v25.85,13.7 | v24,9 24,6.85 v22.4,5.25
  Bottom 0.15: R14.1 15.2,2.1 15.2,2.55 15.25,2.6 16.45,2.6 16.5,2.55 16.5,2.05 R15.2 16.5,2 16.5,1.45 16.8,1.15 18.75,1.15 22.4,4.85 v22.4,5.25 | v22.6,21.25 22.6,21.5 23.35,22.25 24.4,22.25 U10.17 | v25.85,13.7 25.85,10.5 24.25,8.9 v24,9
ADC10  (via drill 0.3)
  Top 0.15: R12.1 15.2,36.4 16.65,36.4 R13.2 16.75,36.4 19.5,36.4 21.45,34.45 v22.9,34.45 | v28.65,27.05 29,27.4 v29,31.4
  Bottom 0.15: U10.29 27.9,27.3 28.15,27.05 v28.65,27.05 | v29,31.4 25.95,34.45 v22.9,34.45
ADC11
  Bottom 0.15: 22.6,37.05 22.6,36.1 R11.2 | 22.6,37.05 25.55,37.05 25.6,37 R10.1 | U10.30 28.4,29.3 28.35,29.35 26.4,29.35 26.2,29.55 25,29.55 24.05,30.5 24.05,31 23.55,31.5 23.05,31.5 20.75,33.8 20,33.8 19.45,34.35 19.45,36.25 20.25,37.05 22.6,37.05
ADC12  (via drill 0.3)
  Top 0.15: v21.7,35.1 19.55,37.25 13.1,37.25 12.45,36.7 P8.P$1
  Bottom 0.15: U10.31 28.9,29.3 28.65,29.55 28.6,29.55 28.5,29.65 26.6,29.65 26.45,29.8 26.45,30.85 26.05,31.25 26.05,31.45 24.25,33.25 23.35,33.25 21.7,34.9 v21.7,35.1
ADC13  (via drill 0.3)
  Top 0.15: v18.7,32.55 15.8,32.55 14.15,34.2 12.45,34.2 P9.P$1
  Bottom 0.15: v18.7,32.55 20.55,32.55 23.45,29.65 23.45,28.1 24.8,26.75 25.05,26.75 25.65,26.15 26.65,26.15 27.75,25.05 29.3,25.05 29.7,25.45 29.7,26.3 29.4,26.6 U10.32
BAT_FILTERED  (via drill 0.5)
  Top 0.4: R6.2 11.75,19.25 11.2,19.8 7.15,19.8 | U4.5 18.15,17.35 18.15,16.55 18.4,16.3 20.15,16.3 20.6,16.75 C6.2 21.2,16.75 | 15.25,29.3 R1.2 | 15.25,29.3 15.8,29.85 17.85,29.85 17.88,29.82 | 17.88,29.82 19.55,28.15 19.55,26.75 19.6,26.7 20.25,26.7 C2.2 | 20.6,30.15 21.4,30.95 21.4,31.7 19.85,33.25 16.55,33.25 15.4,34.4 15.4,34.9 15.45,34.8 15.2,34.7 R12.2 | 17.88,29.82 18.2,30.15 | U1.5 17.85,26.15 18.1,25.9 19.1,25.9 19.55,26.35 19.55,26.55 C2.2 | 21.2,16.75 21.25,16.75 22.2,17.7 22.2,19.65 21.6,20.25 21.6,25.55 20.45,26.7 C2.2 | ANA.P$7 4.45,18.55 3.15,19.85 | 3.15,26 7.05,29.9 14.6,29.9 15.1,29.4 15.25,29.3 | C2.2 20.25,26.9 20.25,27 20.8,27.55 21.85,27.55 22.85,26.55 22.85,25.7 D7.1 | 21.2,16.75 22.45,15.5 22.45,14.8 v23.7,13.55 | v25.2,12.05 25.4,12.25 26.25,12.25 28.3,14.3 28.8,14.3 v29,14.1 | v29.75,15.85 29.9,15.65 34.55,15.65 37.9,12.3 40.8,12.3 v41.45,11.65 | v43.45,9.65 43.45,5.5 44.65,4.3 44.65,3.7 C1.+ 44.7,3.5 44.75,3.55 45.55,3.55 47.35,5.35 R9.2
  Top 0.406: 18.2,30.15 20.6,30.15 | 3.15,26 3,25.85 3,20 3.15,19.85 | v1.8,16.55 3.8,18.55 ANA.P$7 6,18.55 6.1,18.65 6.1,18.8 7,19.7 7.15,19.8
  Bottom 0.4: U3.1 14.2,4.85 13.75,4.4 C9.2 11.8,4.4 11.75,4.35 11.75,3.7 9.5,1.45 9.05,1.45 U2.3 8.85,1.45 4.95,1.45 4.45,1.95 4.45,3.5 0.75,7.45 0.75,14.7 | v25.2,12.05 v23.7,13.55 | v43.45,9.65 v41.45,11.65
  Bottom 0.406: 0.75,14.7 0.75,15.5 v1.8,16.55 | v29,14.1 29,14.45 29.75,15.2 v29.75,15.85
CANRXD
  Bottom 0.15: U10.71 40.4,16.25 41.15,16.25 41.4,16 41.85,16 42.2,16.35 42.2,16.75 41.95,17 41.95,17.45 44.35,19.85 44.35,20.45 45.4,21.5 52.25,21.5 52.55,21.2 54.45,21.2 54.65,21 54.65,19.1 54.7,19.05 55.38,19.05 SOT1.P$4
CANSHDN
  Bottom 0.15: 57.4,19.1 R23.1 | U10.73 40.4,15.25 42.1,15.25 43.45,16.6 43.45,17.45 44.95,18.95 51.4,18.95 52.1,18.25 52.1,16.6 53.9,14.8 56.65,14.8 56.85,15.05 56.85,19.05 57.4,19.05 | 57.4,19.05 57.73,19.05 SOT1.P$5 57.4,19.1 | 57.4,19.1 57.4,19.05
CANTXD
  Bottom 0.15: U10.72 40.4,15.75 41.2,15.75 41.25,15.7 42.05,15.7 43.15,16.8 43.15,17.6 44.8,19.25 51.55,19.25 52.4,18.4 52.4,17.65 53,17.1 55.38,17.1 SOT1.P$1
COMPASS_DRDY  (via drill 0.3)
  Top 0.15: v35.3,8.9 35.35,8.9 36.35,7.9 36.35,7 U60.P$15 | v36.1,9.7 35.8,9.7 34.8,10.7 31.5,10.7 v31.25,10.5
  Bottom 0.15: v36.1,9.7 v35.3,8.9 | v31.25,10.5 31.25,10.8 30.9,11.2 U10.91
D_RXD  (via drill 0.3)
  Top 0.15: v31.9,18.2 31.9,18.5 30.65,19.75 30.65,20.2 28.55,22.3 28.55,25.05 27.65,25.95 27.65,33.7 P2.P$9 | v33.4,18.2 34.4,18.2 37.05,15.55 v37.05,14.7
  Bottom 0.15: v33.4,18.2 v31.9,18.2 | v37.05,14.7 37.05,13.4 36.9,13.3 U10.79
D_TXD  (via drill 0.3)
  Top 0.15: P2.P$8 28.9,33.7 28.9,32.85 27.95,31.9 27.95,26.1 28.85,25.2 28.85,22.5 31,20.35 31,19.85 37.25,13.6 v38,13.6
  Bottom 0.15: U10.78 37.4,13.1 37.9,13.6 v38,13.6
DAC0  (via drill 0.3)
  Top 0.15: ANA.P$5 4.5,21.05 3.75,21.8 v3.75,25.55
  Bottom 0.15: v3.75,25.55 4.25,26.15 4.25,29.95 5.2,30.9 5.2,31.75 6.5,33.05 15.7,33.05 16.15,33.5 20.6,33.5 22.9,31.2 23.4,31.2 23.75,30.85 23.75,28.25 24.95,27.05 25.2,27.05 25.8,26.45 26.8,26.45 27.9,25.35 29.15,25.35 29.4,25.6 29.4,26.15 29.05,26.5 28.1,26.5 27.4,27.2 U10.28
DAC1  (via drill 0.3, 0.3 pad 0.3)
  Top 0.15: 5.5,19.8 ANA.P$6 6.45,19.8 6.9,20.25 7.5,20.25 9.65,22.4 9.65,22.8 9.15,23.3 v9.15,23.4 | v19.2,21.75 19.8,21.15 v20.9,21.15 | v30.65,23.2 30.65,22.9 32.8,20.75 34.45,20.75 v34.75,21.05 | v33.15,13.55 33.15,12.6 SP.P$2
  Bottom 0.15: v9.15,23.4 9.45,23.4 10.55,22.3 11.25,22.3 12.25,23.3 17.05,23.3 18.3,22.05 18.9,22.05 v19.2,21.75 | v20.9,21.15 20.9,21.45 22,22.55 22.6,22.55 22.8,22.75 24.4,22.75 U10.18 26.02,22.77 27.1,23.85 29.6,23.85 30.25,23.2 v30.65,23.2 | v34.75,21.05 34.75,18.05 33.15,16.45 v33.15,13.55
GND  (via drill 0.3, 0.5, 2)
  Top 0.2: SERVO.P$3 51.1,12.8 51.1,15.3 SERVO.P$6 51.1,15.4 51.1,17.85 SERVO.P$9 51.1,17.95 51.1,20.35 SERVO.P$12 51.1,20.45 51.1,22.9 SERVO.P$15 51.1,23 51.1,25.45 SERVO.P$18 51.1,25.55 51.1,28 SERVO.P$21 51.1,28.1 51.1,30.5 SERVO.P$24 51.1,30.6 52.75,32.25 | C25.1 40.6,23.2 40.65,23.25 41.25,23.25 42.4,24.4 C28.1 43.05,24.8 43.2,24.95 43.6,24.95 43.7,24.85 v44,24.85 44.55,25.4 44.55,31.05 45.6,32.1 45.6,34.95 | 52.75,32.25 Q1.2 54.85,32.25 56.65,30.45 I2C1.5 I2C2.5 I2C3.5 I2C4.5 56.63,9.58 S2.P$1 | Q2.2 58.85,32.25 v58.85,31.25 | 52.75,32.25 52.7,32.3 52.7,32.65 50.45,34.9 49.6,34.9 P6.P$2 49.5,34.95 45.6,34.95 | 45.6,34.95 44.75,34.95 P5.P$2 | v33.35,27.05 v32.15,27.05 | v21.1,6.9 20.6,6.4 20.6,5.9 R18.1 | 20.2,9.35 XBEE.10 | GPS.5 12.9,4.45 v14.2,5.75 | C71.2 25.9,8.05 25.95,8 U70.P$26 25.95,6.1 25.9,6.05 25.45,6.05 | 25.4,5.85 U70.P$1 | 25.4,5.85 25.45,5.9 25.45,6.05 | U70.P$27 25.45,6.05 | 25.4,5.85 25.45,5.8 25.45,5.6 25.2,5.35 U70.P$2 23.7,5.35 23.65,5.3 23.65,4.9 23.7,4.85 U70.P$3 24.7,4.85 24.75,4.8 24.75,4.4 24.7,4.35 | R19.1 22,4.3 22.95,4.3 23,4.35 U70.P$4 24.7,4.35 | 24.7,4.35 24.75,4.3 24.75,3.9 24.7,3.85 U70.P$5 23.7,3.85 23.65,3.8 23.65,3.4 23.7,3.35 U70.P$6 24.45,3.35 24.45,1.35 24.5,1.3 C72.2 25.7,1.3 25.75,1.25 25.75,0.8 26,0.55 27.4,0.55 27.5,0.65 27.5,1.25 27.55,1.3 C70.2 28.75,1.3 28.8,1.35 28.8,1.8 29.05,2.05 30.45,2.05 | 30.45,2.05 30.6,1.9 30.85,1.9 31.45,2.5 33.55,2.5 33.6,2.55 33.6,3.05 C62.2 | 33.5,8.4 32.35,9.55 32.35,9.95 32.75,10.35 34.65,10.35 36,9 37.2,9 37.8,9.6 39.05,9.6 C61.1 | 33.5,8.4 33.6,8.3 C63.2 | 37.35,4.85 37.35,5.6 37.45,5.7 38.1,5.7 U60.P$11
  Top 0.2: 37.35,4.85 37.35,4.75 37.4,4.7 38.1,4.7 U60.P$9 | v37.25,4.85 37.35,4.85 | v33.6,8.85 33.6,8.5 33.5,8.4 | v30.25,2.3 30.4,2.15 30.4,2.1 30.45,2.05 | v14,34.95 14.5,35.45 16.1,35.45 16.4,35.15 16.4,34.7 16.6,34.7 R13.1 16.75,34.7 17.65,34.7 17.7,34.65 v20,34.65 | 20.7,23.65 20.7,24.75 20.65,24.8 20.3,24.8 C2.1 20.2,24.8 20.05,25.2 19.95,25.3 | 20.7,23.65 20.7,22.8 R3.2 | 18,25.3 17.85,25.05 17.85,24.4 U1.2 | v19.85,23.65 20.7,23.65 | D2.2 9.85,27.85 9.8,27.8 | 9.8,27.8 9.5,27.5 9.5,24.35 10,23.85 12,23.85 12.05,23.8 C4.1 12.05,22.8 12.05,20 12.5,19.55 12.5,17.95 | 20.6,13.8 20.6,14.85 C6.1 20.15,14.85 20.15,15.4 | 20.6,13.8 R8.2 20.6,12.4 19.8,11.6 | 18.15,15.4 U4.2 | 20.6,13.8 v19.75,13.8 | 6.85,15.45 6.2,14.8 ANA.P$10 5.2,13.65 v5.25,13.6 | 6.85,15.45 7.4,16 | 7.4,16 9.3,17.9 D5.2 10.95,17.9 11,17.95 12.5,17.95 | C23.1 15.75,18.75 15.7,18.7 15.7,18.1 15.6,18 14.15,18 14.1,17.95 12.5,17.95 | 6.85,15.45 8.7,13.6 10.4,13.6 11.1,12.9 12,12.9 12.6,12.3 C5.1 12.6,10.85 12.8,10.65 15.5,10.65 16.45,11.6 19.8,11.6 | v7.35,16.05 7.4,16 | v9.35,27.85 9.75,27.85 9.8,27.8 | 19.8,11.6 v20.05,11.35 | v41.35,2.65 41.35,4 | v26.4,32.2 26.4,33.7 P2.P$10 | v24.85,29 25.05,29.2 25.05,30.9 24.8,31.15 24.8,31.55 v24.25,32.1 | P1.P$2 50,8.85 50.15,9 C27.1
  Top 0.25: 18.15,15.4 18.55,15.75 19.8,15.75 20.15,15.4 | v43.15,34.4 44.2,34.4 44.65,34.85 P5.P$2
  Top 0.26: 19.95,25.3 18,25.3
  Top 0.406: v58.7,3.9 Q4.2 | Q3.2 52.7,4.7 v52.15,4.7 51.6,4.7 51.05,4.15 C1.- | 42.9,34.15 v43.15,34.4 40.55,31.8 40.55,29.85
  Bottom 0.2: 32.05,27.05 32.05,23.7 30.25,21.9 28.2,21.9 28,21.7 27.95,20.8 26.25,19.05 26.25,17.55 25.45,16.75 24.4,16.75 U10.6 | 32.05,27.05 31.9,27.2 U10.37 | 39.8,34.95 39.8,34.5 | 34.45,32.9 34.8,33.25 37.9,33.25 38.65,34 38.65,34.95 38.9,35.2 39.55,35.2 39.8,34.95 | 34.45,32.9 34.45,32 C14.2 34.45,31.9 34.45,30.95 34.4,30.9 34.4,30.3 C15.2 34.3,30.25 33.9,30.25 U10.41 33.85,28.2 33.8,28.15 33.8,27.5 v33.35,27.05 | U10.54 40.4,24.75 41.85,24.75 C13.1 42.4,24.1 42.4,23.8 42.45,23.75 43.6,23.75 44,24.15 v44,24.85 | v58.85,31.25 51.75,31.25 51.1,30.6 SERVO.P$24 | v32.15,27.05 32.05,27.05 | P1.P$2 50,8.9 50,11.7 51.05,12.75 SERVO.P$3 | 19.35,7.5 19.35,8.5 20.15,9.3 XBEE.10 20.15,9.4 20.15,11.25 v20.05,11.35 | 19.35,7.5 19.35,6.85 19.4,6.8 C21.1 20.85,6.8 20.95,6.9 v21.1,6.9 21.15,6.95 21.75,6.95 22,7.2 24.65,7.2 26.7,5.15 27.8,5.15 C50.1 27.85,5.4 27.85,4.8 27.9,4.75 32.1,4.75 32.2,4.65 | R15.1 18.2,2.05 18.2,3.1 16.35,4.95 16.35,5.75 16.3,5.8 U3.2 14.35,5.8 14.3,5.85 | 13.7,6.3 13.85,6.3 14.3,5.85 | 13.7,6.3 C9.1 11.75,6.3 11.6,6.15 11.6,5 9.55,2.95 | v14.2,5.75 14.3,5.85 | 19.35,7.5 14.1,7.5 13.7,7.1 13.7,6.3 | 34.1,10.65 34.7,11.4 34.8,11.5 34.8,11.85 34.9,11.95 U10.83 | 34.1,10.65 C12.1 34,10.65 | 37.25,4.3 39.75,4.3 39.8,4.35 SPI.7 39.75,4.25 | 37.25,4.3 36.7,4.3 35.4,5.6 U50.7 33.4,5.6 | 32.2,4.65 33.1,5.55 33.25,5.55 33.3,5.6 33.4,5.6 | 32.2,4.65 32.05,4.5 32.05,3.2 32.2,3.05 32.2,1.9 32.15,1.85 C51.1 30.3,1.85 30.25,1.9 v30.25,2.3 | 37.25,4.3 v37.25,4.85 | 33.6,10.65 34,10.65 | 34.1,10.65 34,10.65 | 34.1,10 33.55,8.35 33.4,8.2 33.4,5.6 | 34.1,10 34.1,10.65 | v33.6,8.85 34.1,10
  Bottom 0.2: R21.1 14.15,34.7 13.95,34.9 | 13.95,34.9 13.5,35.35 8.5,35.35 | 8.5,35.35 7.4,34.25 P9.P$3 7.1,34.3 5.25,32.45 1.85,32.45 0.65,31.25 0.65,27.3 1.55,27.3 SD.GND1 1.65,27.3 2.3,27.3 2.9,26.7 2.9,26.3 2.6,26 2.6,14.19 SD.GND3 | 8.5,35.35 7.35,36.5 7.35,36.65 P8.P$3 | C11.1 28.8,30.4 27.25,30.4 C16.1 27.15,30.4 26.8,30.4 26.8,31 26.4,31.4 v26.4,32.2 | v14,34.95 13.95,34.9 | 3,14.2 2.95,14.15 2.65,14.15 SD.GND3 | C19.1 20.95,25.75 21.4,25.75 21.45,25.7 21.45,24.6 21.4,24.55 20.95,24.55 C20.1 20.85,24.55 20.45,24.55 19.8,23.9 19.8,23.65 | 19.8,23.65 19.8,21.55 19.05,20.8 15.8,20.8 15.75,20.85 15.75,21.45 SD.CD2 15.75,20.75 15.75,20.5 12.85,17.6 8.9,17.6 v7.35,16.05 6.25,17.15 5.3,17.15 SD.6 | v19.85,23.65 19.8,23.65 | 13.8,26.85 11,29.65 8.5,29.65 C90.1 8.5,28.7 v9.35,27.85 | v19.75,13.8 19.1,14.45 18,14.45 C10.2 | v5.25,13.6 5,13.85 4.25,13.85 3.95,14.15 3.05,14.15 SD.GND3 | U10.26 26.4,28.85 26.05,29.2 25.05,29.2 v24.85,29 | v20,34.65 20.85,35.5 | 20.85,35.5 20.9,35.55 R11.1 | USB.GND 32.55,33.8 33.3,33.05 34.3,33.05 34.45,32.9 | v24.25,32.1 23.7,32.1 20.95,34.85 20.95,35.05 20.9,35.1 20.9,35.45 20.85,35.5 | 22.1,10.65 22.21,10.65 | 8.79,2.96 8.45,3.1 | 42.7,34.4 42.65,34.4 41.85,35.2 40.1,35.2 39.85,34.95 39.8,34.95
  Bottom 0.25: C24.1 53.8,19.4 53.75,19.35 53,19.35 52.9,19.1 52.9,17.85 53.25,17.5 54.45,17.5 54.75,17.75 55.38,17.75 | R24.2 55.9,16.55 56.25,16.55 56.35,16.6 56.35,17.75 55.38,17.75 | v43.15,34.4 42.7,34.4 | 55.38,17.75 SOT1.P$2
  Bottom 0.406: 8.45,3.1 8.3,2.95 6.35,2.95 6.35,5.4 C7.1 | v66.7,2 64.8,3.9 64.8,4.45 64.3,4.95 62.85,4.95 61.8,3.9 v58.7,3.9
  other vias: 2.7,36 66.7,36 57.45,9.45
  pour Bottom (isolate 0.254): 0,37.95 -0.05,0.05 69.2,0 69.2,38 1.25,37.95
  pour Top (isolate 0.254): 0,37.95 -0.05,0.05 69.2,0 69.2,38
GPS_RX  (via drill 0.3)
  Top 0.15: v31.2,14.35 30.45,15.1 29.5,15.1 29.25,14.75 28.1,14.75 26.05,12.7 24.95,12.7 21.3,9.05 21.3,9 20.9,8.6 20.9,8.25 19.7,7.05 18.65,7.05 15.65,4.05 v15.15,4.05 | v11.05,2.05 9.6,2.05 9.15,2.5 GPS.2
  Bottom 0.15: U10.89 31.9,13.3 v31.2,14.35 | v11.05,2.05 12.5,3.5 14.6,3.5 v15.15,4.05
GPS_TX  (via drill 0.3)
  Top 0.15: v25.75,15.25 25.75,14.85 24.35,13.45 24.35,13.3 21.85,10.8 v19.45,10.8 | v5.9,7.2 8.4,7.2 10.1,5.5 10.1,4.87 GPS.3 10.4,4.95
  Bottom 0.15: U10.88 32.4,16.35 34.15,18.1 34.15,22.05 33.4,22.8 33,22.8 25.75,15.55 v25.75,15.25 | v19.45,10.8 18.25,10.8 17.2,9.75 17.2,8.9 16.3,7.9 6.65,7.9 v5.9,7.2
GYRO_DRDY  (via drill 0.3)
  Top 0.15: U70.P$17 29.9,4.35 29.95,4.4 v29.95,6.8
  Bottom 0.15: v29.95,6.8 29.5,7.25 29.5,8.05 30.75,9.25 31.6,9.25 32.15,9.8 32.15,10.55 32.6,10.95 32.9,11.2 U10.87
GYRO_ENABLE  (via drill 0.3)
  Top 0.15: U70.P$16 29.9,3.85 30.25,4.2 30.25,5.1 v30.5,5.35
  Bottom 0.15: v30.5,5.35 30.15,5.35 29.2,6.3 29.2,8.2 30.65,9.6 31.4,9.6 31.8,10 31.8,10.8 31.4,11.2 U10.90
LED1  (via drill 0.3)
  Top 0.15: v26.75,11.05 26.2,10.5 23.6,10.5 19.75,6.65 19.75,5.35 19.35,4.95 19.35,4.3 18.9,4.3 LD1.A
  Bottom 0.15: v26.75,11.05 26.9,11.2 U10.99
LED2  (via drill 0.3)
  Top 0.15: v27.25,10.45 27,10.2 23.75,10.2 21.65,8.1 21.65,5.55 20.85,4.75 20.85,4.35 20.4,4.35 LD2.A
  Bottom 0.15: v27.25,10.45 27.25,10.55 27.9,11.2 U10.97
N$1  (via drill 0.3)
  Top 0.15: 32.7,33.45 32.65,33.7 P2.P$5 33,33.37 33,32.7 34.4,31.3 34.75,31.3 35.4,30.65 35.4,26.4 v34.5,25.5
  Bottom 0.15: v34.5,25.5 33.6,24.6 33.6,23.85 25.5,15.75 24.4,15.75 U10.4
N$2  (via drill 0.3)
  Top 0.15: v26.75,15.8 23.5,15.8 v23.15,15.45 | P2.P$4 33.9,33.7 33.9,33 35.75,31.15 35.75,25.65 36.45,24.95 36.45,22.95 35.4,21.9 v32.9,21.9
  Bottom 0.15: v32.9,21.9 32.55,21.9 26.75,16.1 v26.75,15.8 | v23.15,15.45 23.35,15.25 24.4,15.25 U10.3
N$3
  Bottom 0.15: C18.1 41.1,31.95 41.15,31.9 41.45,31.9 X1.P$1 41.05,31.9 40.5,31.9 40.45,31.85 39.95,31.85 37.4,29.3 U10.48
N$4  (via drill 0.3)
  Top 0.15: v39.05,33.05 38.8,33.3 38.8,34.8 38,35.6 v37.8,35.6 | v37.1,27.05 36.65,27.5 v36.65,30.4
  Bottom 0.15: v39.05,33.05 37.9,31.9 37,31.9 X1.P$2 36.95,31.9 36.7,31.9 36.65,31.85 v36.65,30.4 | C17.1 37.35,34.5 37.35,35.15 v37.8,35.6 | U10.47 36.9,27.2 37.05,27.05 v37.1,27.05
N$5
  Top 0.15: R18.2 18.9,5.85 18.9,5.4 19,5.5 18.5,5.5 17.9,4.9 17.9,3.18 LD1.C 18.85,2.2
N$6  (via drill 0.3)
  Top 0.15: 17.85,27.95 18.75,27.95 18.8,27.9 18.8,27 U1.4 | 17.85,27.95 17.35,27.95 16.95,28.35 16.95,28.8 R1.1 | v17.85,28.05 17.85,27.95
  Bottom 0.15: v17.85,28.05 18.9,28.05 C22.2
N$7
  Top 0.15: 21.5,2.6 R19.2 | 20.4,2.25 LD2.C
  Top 0.406: 21.5,2.6 20.77,2.6 LD2.C
N$8
  Top 0.4: U1.6 16.9,26.95 16.9,26.2 16.85,26.15 15.5,26.15 15.5,26.4 C3.1 15.5,26.6 15.5,26.9 14.6,27.8 14.2,27.8 13.95,28.05 13.15,28.05 L1.1 12.95,28.05 12,28.05 11.25,27.3 11.25,25.95 10.85,25.55 D2.1
N$9
  Top 0.2: 18.8,22.75 17.2,22.75 R2.2 | 18.8,22.75 18.8,24.35 U1.3 | 18.8,22.75 R3.1
N$10  (via drill 0.3)
  Top 0.15: D3.1 10.8,22.35 10.9,22.45 v10.9,23.15 | U1.1 16.9,24.4 16.9,25.35 v16.8,25.45 16.75,25.2 15.5,25.2 15.5,24.75 C3.2
  Bottom 0.15: v10.9,23.15 10.9,22.95 11.9,23.95 15.25,23.9 v16.8,25.45
N$11  (via drill 0.3)
  Top 0.15: SP.P$1 31,23.95 v30.5,24.45
  Bottom 0.15: U10.21 24.4,24.25 25.15,24.25 25.6,24.7 30.1,24.7 30.45,24.35 30.45,24.45 v30.5,24.45
N$12
  Top 0.15: U60.P$10 38.15,5.2 38.8,5.2 38.85,5.25 38.85,7.75 38.9,7.8 39.15,7.8 C61.2
N$13
  Top 0.15: U60.P$8 37.35,3.95 37.35,2.25 C60.2
N$14
  Top 0.15: U60.P$12 38.15,6.2 38.05,6.2 38.05,8.4 38.35,8.7 40,8.7 40.7,8 40.7,4.4 39.25,2.95 39.25,2.25 C60.1
N$15
  Top 0.15: U70.P$15 32.5,3.35 33.05,3.9 34.2,3.9 34.45,3.65 34.45,2.25 34.35,2.15 31.6,2.15 30.75,1.3 C70.1
N$16  (via drill 0.5)
  Top 0.4: 53.6,35.5 53.6,36.5 P10.+ | 58.95,35.5 59,35.55 59,36.5 P11.+ | 57.75,34.75 57.75,31.4 60.1,29.05 62.1,29.05 62.5,28.65
  Top 0.406: 62.5,28.65 62.5,11 63.25,10.25 J2.P$1 64.35,10.25 64.85,9.75 64.85,7.6 64.5,7.25 J3.P$1 63.95,4.15 v63.75,3.95 | 57.75,34.85 55.1,34.85 53.55,36.4 53.58,36.4 P10.+ | 57.75,34.85 58.7,35.8 58.75,35.8 59,35.55 | v58.8,1.75 P13.+ | v55.3,3.45 55.3,3.02 P12.+ | 57.75,34.85 57.75,34.75
  Bottom 0.406: v63.75,3.95 61.55,1.75 v58.8,1.75 57,1.75 v55.3,3.45
N$17  (via drill 0.3)
  Top 0.15: P2.P$3 35.15,33.7 35.15,32.4 36.05,31.5 36.05,25.85 36.75,25.15 36.75,22.75 35.6,21.6 33.8,21.6 v33.55,21.35
  Bottom 0.15: v33.55,21.35 32.5,21.35 30.85,19.75 30.85,18.7 26.85,14.7 25.1,14.7 25.05,14.75 24.4,14.75 U10.2
N$18
  Top 0.4: U4.6 17.2,17.25 16.05,17.25 16,17.1 C8.1 15.8,16.85 14.3,16.85 14.25,16.9 13.4,16.9 L2.1 13.25,16.9 12.65,16.9 12.6,16.85 12.6,15.6 12.15,15.15 11.65,15.15 11.2,15.6 D5.1
N$19
  Bottom 0.15: C14.1 32.55,31.9 32.5,31.6 32.5,30.25 C15.1 32.7,30.25 33.4,30.25 U10.40
N$20
  Top 0.2: R7.2 17.8,12.8 17.85,12.85 18.9,12.85 R8.1 18.9,13.85 19.1,14.05 U4.3
N$21  (via drill 0.3)
  Top 0.15: v11.3,12.25 D6.1 | v15.85,14.3 15.95,14.4 15.95,15 | U4.1 17.2,15 15.95,15 | C8.2 15.95,15
  Bottom 0.15: v11.3,12.25 13.65,12.25 v15.85,14.3
N$22  (via drill 0.3)
  Top 0.15: Q1.3 56.25,33.2 56.7,33.2 56.75,33.25 | 56.25,35.65 56.1,35.5 56.1,36.5 P10.-
  Top 0.406: v57.35,35.6 57.1,35.65 56.25,35.65 | 56.25,33.2 56.4,33.2 57.05,33.85 v57.05,34.15
  Bottom 0.406: v57.05,34.15 57.05,35.3 v57.35,35.6
N$23  (via drill 2)
  other vias: 2.7,2
N$24
  Top 0.15: 61.55,33.2 Q2.3 | 61.55,35.45 61.5,35.5 61.5,36.5 P11.-
  Top 0.406: 61.55,35.45 61.55,33.2
N$25
  Top 0.406: Q3.3 56.55,4 56.55,1.85 56.57,1.83 P12.-
N$26
  Top 0.406: Q4.3 62.7,4.85 62.7,2.8 62.65,2.75 62.65,1.75 P13.-
N$28  (via drill 0.3)
  Top 0.15: v30.85,27.05 v30.85,31.4
  Bottom 0.15: USB.D+ 31.25,31.8 v30.85,31.4 | v30.85,27.05 31.4,27.6 U10.36
N$29  (via drill 0.3)
  Top 0.15: v37.1,26.2 37.7,26.8 37.7,30.75 36.4,32.05 36.4,33.7 P2.P$2 | v27.65,18.65 27.65,14.75 25.9,13 25.45,13 v25.2,13.25
  Bottom 0.15: v37.1,26.2 34.35,26.2 33.3,25.15 33.3,24 27.95,18.65 v27.65,18.65 | v25.2,13.25 25.2,14.2 25.15,14.25 24.4,14.25 U10.1
N$30
  Bottom 0.15: USB.D- 30.6,31.9 29.75,31.05 29.75,29.8 30.2,29.35 30.85,29.35 30.9,29.3 U10.35
N$31
  Bottom 0.15: C19.2 22.65,25.75 24.4,25.75 U10.24
N$32
  Bottom 0.15: C20.2 22.65,24.55 23.1,24.55 23.3,24.75 23.3,24.8 23.55,25.05 23.55,25.2 23.6,25.25 24.4,25.25 U10.23
N$33  (via drill 0.5)
  Top 0.4: v44.25,7.6 D1.1 45.4,7.45 45.45,7.35 R9.1
  Bottom 0.4: v44.25,7.6 D4.1
N$34
  Top 0.25: 44.4,36.4 44.7,36.4 P5.P$3 44.8,36.4 49.55,36.4 P6.P$3
  Bottom 0.25: Q5.3 43.7,28.5 43.75,28.55 43.75,35.75 44.4,36.4 44.7,36.4 P5.P$3
N$35
  Bottom 0.15: R24.1 57.73,15.85 SOT1.P$8
PPS  (via drill 0.3)
  Top 0.15: v22.2,6.6 22.2,8.2 23.9,9.9 27.45,9.9 v28.05,10.5 28.05,11.5 30,13.45 v30,14.4 | v16.5,6.4 16.25,6.15 15.55,6.15 14.5,7.2 13.55,7.2 11.9,5.55 11.9,5.25 11.5,5.25 11.4,5.15 | 11.65,4.75 GPS.4 11.6,5.25 9,7.85 2.25,7.85 1.15,8.85 1.15,9.7 2.25,10.8 4.2,10.8 4.3,10.9 4.3,13.35 3.45,14.2 3.45,16.45 v3.7,16.7 | v29.1,20.55 29.05,20.55 30.95,18.65 v30.95,17.6 | v4.8,29.15 3.95,30 3.35,30 2.2,31.15 2.2,31.3 XBEE.20
  Top 0.2: 11.4,5.15 11.4,4.57 GPS.4
  Bottom 0.15: U10.96 28.4,10.85 v28.05,10.5 | v22.2,6.6 21.55,6.6 21,6.05 20.85,6.05 20.7,5.9 19,5.9 18.8,6.1 16.8,6.1 v16.5,6.4 | U10.43 34.9,27.2 32.95,25.25 32.95,24.1 29.4,20.55 v29.1,20.55 | v30.95,17.6 30.95,17.5 30.85,17.4 30.85,15.25 v30,14.4 | v4.8,29.15 4.55,28.9 4.55,24.1 3.6,23.15 3.6,16.8 v3.7,16.7
PWM0  (via drill 0.3)
  Top 0.15: v39.15,18.75 40.4,17.5 41.9,17.5 45.45,13.95 45.45,13.3 45.95,12.8 SERVO.P$1
  Bottom 0.15: v39.15,18.75 40.4,18.75 U10.66
PWM1  (via drill 0.3)
  Top 0.15: v41.65,18.35 41.95,18.35 45,15.3 45.95,15.3 SERVO.P$4
  Bottom 0.15: v41.65,18.35 41.65,19.05 41.45,19.25 40.4,19.25 U10.65
PWM2  (via drill 0.3)
  Top 0.15: v42.05,19.45 44.4,19.45 45.95,17.9 SERVO.P$7
  Bottom 0.15: v42.05,19.45 41.75,19.75 40.4,19.75 U10.64
PWM3  (via drill 0.3)
  Top 0.15: v42.7,20.3 43.3,20.3 43.6,20.6 45.75,20.6 45.95,20.4 SERVO.P$10
  Bottom 0.15: v42.7,20.3 42.65,20.25 40.4,20.25 U10.63
PWM4  (via drill 0.3)
  Top 0.15: v52.5,34.15 Q1.1
  Bottom 0.15: v52.5,34.15 52.2,34.15 50.75,32.7 50.75,32.4 49.65,31.3 49.65,27.7 48.55,26.6 48.25,26.6 47.1,25.45 47.1,24.05 46,22.95 SERVO.P$13 45.95,22.9 43.6,22.9 41.45,20.75 40.4,20.75 U10.62
PWM5  (via drill 0.3)
  Top 0.15: Q2.1 59.8,34.15 v60.25,34.6 | v39.15,19.7 41.05,17.8 42.05,17.8 45.65,14.2 46.3,14.2 47.1,15 47.1,24.35 46,25.45 SERVO.P$16
  Bottom 0.15: v60.25,34.6 60.25,34.9 58.85,36.3 53.9,36.3 50.45,32.85 50.45,32.55 49.55,31.65 48.2,31.65 47.3,30.75 47.3,26.85 45.95,25.5 SERVO.P$16 | v39.15,19.7 39.15,21.05 39.35,21.25 40.4,21.25 U10.61
PWM6  (via drill 0.3)
  Top 0.15: Q3.1 53.55,5.9 53.5,5.95 52.35,5.95 v52.2,6.1 | v51.7,10.8 51.4,10.8 50.6,11.6 v49.1,11.6 | SERVO.P$19 47.4,26.6 47.4,13.4 v47.35,13.35 47.3,13.3 47.3,12.65 46.3,11.65 45.7,11.65 44.6,12.75 44.6,14.35 41.75,17.2 39.95,17.2 38.45,18.7 v38.45,20.85
  Bottom 0.15: v51.7,10.8 52.45,10.05 52.45,6.35 v52.2,6.1 | v49.1,11.6 48.3,11.6 47.35,12.55 v47.35,13.35 | v38.45,20.85 39.35,21.75 40.4,21.75 U10.60
PWM7  (via drill 0.3)
  Top 0.15: v50.2,29.25 49.95,29.5 49.95,31.75 49.75,31.95 47.35,31.95 46,30.6 SERVO.P$22 | Q4.1 v61.5,5.8
  Bottom 0.15: v50.2,29.25 53.15,29.25 63.25,19.15 63.25,11.2 62.5,10.45 59.8,10.45 59.05,9.7 59.05,9 59.25,8.8 59.25,8.05 60.15,7.15 60.3,7 v61.5,5.8 | U10.59 40.4,22.25 42.5,22.25 43.45,23.2 43.55,23.2 44.9,24.55 44.9,29.5 45.95,30.55 SERVO.P$22
RST  (via drill 0.3)
  Top 0.15: 31.4,29.85 31.4,33.7 P2.P$6 | S1.P$1 31.4,29.85 | v32.1,20.1 31.8,20.35 31.8,20.75 29.55,23 29.55,25 31.4,26.85 31.4,29.85
  Bottom 0.15: v32.1,20.1 31.75,19.9 31.75,19.15 28.05,15.45 28.05,13.85 27.4,13.2 U10.98
RXD0  (via drill 0.3)
  Top 0.15: v27.85,9.35 v28.95,10.45
  Bottom 0.15: U10.93 29.9,11.1 29.25,10.45 v28.95,10.45 | v27.85,9.35 27.6,9.6 25.85,9.6 24.3,8.05 23.6,8.05 23.05,8.6 23.05,12 21.8,13.2 19.85,13.2 17.8,11.1 14.5,11.1 13.2,9.75 13.2,8.9 12.55,8.25 4.95,8.25 4.2,9.15 4.2,9.3 XBEE.2
S_RXD1  (via drill 0.3)
  Top 0.15: v36.15,15.5 v34.65,17 | v38.55,15.65 40.85,15.65 v41.65,16.55 | v44.9,22.3 44.9,28.5 45.55,29.15 v46.75,29.15
  Bottom 0.15: U10.85 33.9,16.25 v34.65,17 | v36.15,15.5 36.3,15.65 v38.55,15.65 | v41.65,16.55 41.65,17.6 43.25,19.2 43.25,20.25 44.9,21.9 v44.9,22.3 | v46.75,29.15 46.75,29.9 47,30.15 47,30.95 44.75,33.2 44.75,33.4 P5.P$1
SCL0  (via drill 0.3)
  Top 0.15: R4.2 42.15,21.35 42.15,22.4 41.9,22.4 C25.2 41.9,23.4 42.6,24.1 43.15,24.1 v43.4,24.35 | U70.P$24 26.95,5.8 v26.9,5.75 | 30.3,8.85 31.2,8.85 32.12,7.93 | 30.3,8.85 v29.1,8.85 | 32.12,7.93 33,7.05 34.1,7.05 34.45,6.7 34.45,6.25 34.5,6.2 35.1,6.2 U60.P$1 | 32.12,7.93 v32.55,8.35 | v37.85,24.6 37.85,14.55 39.05,13.35 40.8,13.35 42.1,12.05 42.1,10.4 41.8,10.1 41.3,10.1 40.4,11 38.95,11 38.35,11.6 37.9,11.6 35.4,14.1 32.15,14.1 30.3,12.25 30.3,8.85
  Bottom 0.15: 40.4,25.75 U10.52 | v26.9,5.75 26.9,6.35 29.1,8.55 v29.1,8.85 | v32.55,8.35 U50.5 | v37.85,24.6 38,24.6 39.15,25.75 40.35,25.75 U10.52 | v43.4,24.35 43.4,26.6 43.2,26.8 41.6,26.8 41.5,26.7 41.5,25.8 41.45,25.75 40.45,25.75 U10.52
SCL1  (via drill 0.3)
  Top 0.15: v38.8,22.95 39.05,22.7 39.05,20.55 39.8,19.8 40.95,19.8 44,16.75 v44.5,16.75 | 60.4,22.05 I2C2.2 | I2C2.2 60.4,21.1 60.4,20.9 | 60.4,20.9 I2C3.2 | I2C2.2 I2C1.2 60.4,27.55 | I2C3.2 v60.4,12.8 I2C4.2 | 60.4,16.55 I2C3.2 | 53.3,9.17 R17.2 55.18,10.33 55.95,11.1 | 60.4,20.9 v59.8,20.3
  Top 0.153: 55.95,11.1 v55.95,13.4
  Top 0.2: C27.2 53.3,9.17
  Bottom 0.15: v38.8,22.95 39.6,23.75 40.4,23.75 U10.56 | v44.5,16.75 51.5,16.75 54.15,14.1 55.7,14.1 | 61.55,17.35 60.1,18.8 | 60.1,18.8 59.7,18.4 57.73,18.4 SOT1.P$6 | 55.7,14.1 59.1,14.1 v60.4,12.8 | v55.95,13.4 55.95,13.85 55.7,14.1 | v59.8,20.3 59.8,19.1 60.1,18.8
SD_DETECT  (via drill 0.3)
  Top 0.15: v25.8,21.15 v25.8,23.3 | v25.65,17.75 23.4,17.75 v22.6,16.95
  Bottom 0.15: v25.8,23.3 24.4,23.3 U10.19 | v25.8,21.15 25.8,20.85 25.9,20.75 25.9,20.25 26.2,19.95 26.2,19.5 25.85,19.15 25.85,17.95 v25.65,17.75 | v22.6,16.95 22.25,16.6 19.8,16.6 19.05,17.35 16.35,17.35 15.75,16.75 15.75,15.8 SD.CD1
SDA0  (via drill 0.3)
  Top 0.15: C28.2 42.25,25.95 R5.2 39.5,25.95 v39.15,26.3 | U70.P$28 24.95,7.1 24.85,7.2 24.6,7.2 24.55,7.25 24.55,8.85 25.3,9.6 26.85,9.6 27.65,8.8 28.05,8.8 28.55,8.3 v30.6,8.3 | v32.95,9.75 33.7,9.75 34.6,8.85 | 34.6,8.85 35.85,7.6 35.85,7 U60.P$16 | v34.5,8.75 34.6,8.85 | v37.3,24.05 37.3,20.9 v36,19.6 | v38.65,14.5 39.5,13.65 40.95,13.65 42.45,12.15 42.45,10.3 41.75,9.6 v41.75,9.25 | v37.9,10.2 37.3,9.6 v36.9,9.6
  Bottom 0.15: U10.51 40.4,26.25 39.2,26.25 v39.15,26.3 39.15,26.2 38.1,25.15 37.65,25.15 37.3,24.8 v37.3,24.05 | v30.6,8.3 31.5,8.3 v32.95,9.75 | U50.6 34.05,8.3 v34.5,8.75 34.9,8.35 35.5,8.35 36.75,9.6 v36.9,9.6 | v36,19.6 35.6,19.2 35.6,15.25 35.95,14.85 36.4,14.85 36.45,14.9 36.75,15.3 37.85,15.3 v38.65,14.5 | v41.75,9.25 38.85,9.25 v37.9,10.2
SDA1  (via drill 0.3)
  Top 0.15: I2C3.1 I2C4.1 | v39.1,24 39.35,23.75 39.35,20.7 39.95,20.1 42.15,20.1 42.5,19.75 43.5,19.75 v43.8,20.05 | 61.65,22.05 I2C2.1 | v52.75,11.45 52.5,11.7 52.5,21.5 v52.75,21.75 | I2C2.1 I2C1.1 61.65,27.55 | I2C2.1 61.65,20.85 | 61.65,20.85 61.65,16.35 I2C3.1 | 61.65,20.85 v61.05,20.25 | I2C3.1 61.65,15.45 v61,14.8
  Top 0.2: 61.65,11.25 S2.P$2
  Top 0.406: I2C4.1 61.63,11.27 61.65,11.25
  Bottom 0.15: C26.2 54.85,7.95 54.65,8.15 R16.2 54.65,8.1 53.5,8.1 52.75,8.85 v52.75,11.45 | v39.1,24 39.35,24.25 40.4,24.25 U10.55 | v43.8,20.05 43.8,20.35 45.25,21.8 52.75,21.8 | 52.75,21.8 59.85,21.8 61.05,20.6 v61.05,20.25 | v52.75,21.75 52.75,21.8 | v61,14.8 61,15.5 58.75,17.75 57.73,17.75 SOT1.P$7
SERVO_VCC
  Top 0.4: SERVO.P$23 48.55,28.2 SERVO.P$20 48.55,25.65 SERVO.P$17 48.55,25.45 48.55,23.1 SERVO.P$14 48.55,22.9 48.55,20.6 SERVO.P$11 48.55,20.35 48.55,18.05 SERVO.P$8 48.55,15.5 SERVO.P$5 48.55,12.95 SERVO.P$2 48.5,12.75 45.65,9.9 D1.2 44.4,10.8 J1.P$1
SPI0_CS0  (via drill 0.3)
  Top 0.15: v38.1,11 38.4,10.7 40.25,10.7 41.2,9.75 41.2,9 v42.05,8.15
  Bottom 0.15: U10.77 37.9,11.2 v38.1,11 | SPI.4 43.55,6.4 42.05,7.9 v42.05,8.15
SPI0_MISO  (via drill 0.3)
  Top 0.15: v49.7,15.9 49.65,15.95 49.65,31.6 49.6,31.65 48.2,31.65 47.45,30.9 47.45,30.6 46.3,29.45 45.7,29.45 44.9,30.25 44.9,30.9 45.65,31.65 46.6,31.65 47.2,32.25 48.4,32.25 49.55,33.4 P6.P$1
  Bottom 0.15: 43.48,11.68 44.5,10.65 44.5,9.6 46.05,8.05 SPI.2 | 43.48,11.68 40.9,14.25 40.4,14.25 U10.75 | v49.7,15.9 49.7,15.05 48.55,13.9 45.7,13.9 43.48,11.68
SPI0_MOSI
  Bottom 0.15: SPI.1 47.3,6.15 48.7,7.55 48.7,10.05 49.65,11 49.65,12.75 50.8,13.9 51.1,13.9 52.2,15 52.2,15.6 51.35,16.45 44.95,16.45 43.25,14.75 40.4,14.75 U10.74
SPI0_SCK  (via drill 0.3)
  Top 0.15: v39.15,11.55 40.3,11.55 41.2,10.65 v41.5,10.65
  Bottom 0.15: U10.76 38.4,11.8 38.65,11.55 v39.15,11.55 | v41.5,10.65 43.6,8.55 43.6,7.1 44.8,5.9 SPI.3
SPI1_CS3  (via drill 0.3)
  Top 0.15: v22.35,30 22.35,31 25.65,34.3 25.65,35.15 26.7,36.2 35.77,36.2 36.97,35 38.1,35 38.5,34.6 v38.5,31.75
  Bottom 0.15: v22.35,30 22.4,30 23,29.4 23,29 22.15,28.05 20.5,28.05 19.7,27.25 19.7,25.15 19.6,25.05 17.95,25.05 17,26 11.75,26 10.8,25.05 6.5,25.05 5.9,24.45 5.9,23.7 6.65,22.95 6.65,21.65 6.55,21.55 5.9,21.55 SD.2 | v38.5,31.75 38.5,30.85 37,29.35 35.95,29.35 35.9,29.3 U10.45
SPI1_MISO  (via drill 0.3)
  Top 0.15: v8.85,15.5 9.6,16.25 11.2,16.25 11.6,15.85 v11.9,15.85 | v21.2,17.9 v19.85,17.9
  Bottom 0.15: v8.85,15.5 7.15,15.5 6.6,16.05 5.5,16.05 SD.7 | v11.9,15.85 13.6,15.85 15.4,17.65 19.6,17.65 v19.85,17.9 | v21.2,17.9 21.3,17.8 23.3,17.8 23.35,17.75 24.4,17.75 U10.8
SPI1_MOSI  (via drill 0.3)
  Top 0.15: v12.9,20.05 14.4,21.55 16.55,21.55 18.2,19.9 v18.6,19.9
  Bottom 0.15: v12.9,20.05 10.8,17.95 8.1,17.95 7.75,18.3 7.75,18.35 6.65,19.45 6.65,19.95 6.15,20.45 5.5,20.45 SD.3 | v18.6,19.9 20.5,18 20.5,17.75 21,17.25 21.35,17.25 21.6,17.5 23.1,17.5 23.35,17.25 24.4,17.25 U10.7
SPI1_SCK  (via drill 0.3)
  Top 0.15: v7.35,17.95 8.75,19.35 10.5,19.35 v10.75,19.1 | v14.65,20.2 17,20.2 18.15,19.05 19.25,19.05 19.5,19.3 v20.3,19.3
  Bottom 0.15: v7.35,17.95 6.6,17.95 6.3,18.25 5.5,18.25 SD.5 | v10.75,19.1 12.35,20.7 14.15,20.7 v14.65,20.2 | v20.3,19.3 21.1,18.5 21.45,18.5 21.7,18.25 24.4,18.25 U10.9
SW_RECEIVER  (via drill 0.3)
  Top 0.15: R22.2 40.65,27.25 39.95,27.25 v39.65,27.55
  Bottom 0.15: Q5.1 v39.65,27.55 38.45,27.55 38.4,27.6 U10.50
TXD0  (via drill 0.3)
  Top 0.15: v23,12.85 21.5,11.35 v21.05,11.35 | v21.05,10.25 21.05,10.4 20.95,10.5 19.95,10.5 19.7,10.25 19.2,10.25 18.9,10.55 15.9,10.55 15.2,9.85 15.2,8.9 14.5,8.2 13.9,8.2 13.2,8.9 13.2,9.75 12.5,10.45 7.15,10.45 6.2,9.5 6.2,9.35 XBEE.3
  Bottom 0.15: U10.92 30.4,11.15 29.15,9.9 25.7,9.9 24.15,8.35 23.75,8.35 23.4,8.75 23.4,12.35 v23,12.85 | v21.05,10.25 v21.05,11.35
VBUS  (via drill 0.3)
  Top 0.15: v29.95,32 29.95,27.15 v30.05,27.05
  Top 0.2: D7.2 24.1,23.4 24.8,24.1 v25.85,24.1
  Bottom 0.15: v29.95,32 USB.VBUS | v30.05,27.05 30.15,27.15 30.2,27.15 30.4,27.35 U10.34
  Bottom 0.2: v30.05,27.05 31,26.05 31.55,25.45 31.55,24.5 30.9,23.85 30.15,23.85 29.65,24.35 26.1,24.35 v25.85,24.1
XBEE_CTS  (via drill 0.3)
  Top 0.15: v28.85,15.3 28.5,15.65 28.5,18.6 26.4,20.7 26.4,24.65 23,28.05 21.45,28.05 v20.1,29.4
  Bottom 0.15: 28.85,15.35 v28.85,15.3 28.35,14.75 28.35,13.85 28.9,13.3 U10.95 | v20.1,29.4 18.15,31.35 18.17,31.35 XBEE.12
XBEE_RST
  Bottom 0.15: U10.20 24.4,23.75 23.35,23.75 22.45,22.85 21.85,22.85 19.45,20.45 18.3,20.45 15.8,17.95 15.25,17.95 13.45,16.15 12.35,16.15 12.1,16.4 11.7,16.4 9.45,14.15 9.45,11.5 9.35,11.4 9.35,10.15 10.15,9.35 XBEE.5
XBEE_RTS  (via drill 0.3)
  Top 0.15: v31.7,17.2 31.5,16.95 30.6,16.95 26.75,20.8 26.75,24.75 22.95,28.55 21.8,28.55 v21.75,28.6
  Bottom 0.15: U10.94 29.4,13.3 29.85,13.6 30.5,14.05 30.7,14.65 31.15,15.1 31.15,16.75 v31.7,17.2 | v21.75,28.6 21.6,28.6 21.55,28.55 19.5,28.55 19.4,28.65 12.7,28.65 10.2,31.15 10.2,31.3 XBEE.16

## Text on the board
tPlace: RC1 | RC2 | 8 | 7 | Maveric32 v4.1 | 2014 F. Schill | 6 | 5 | 4 | 3 | 2 | 1